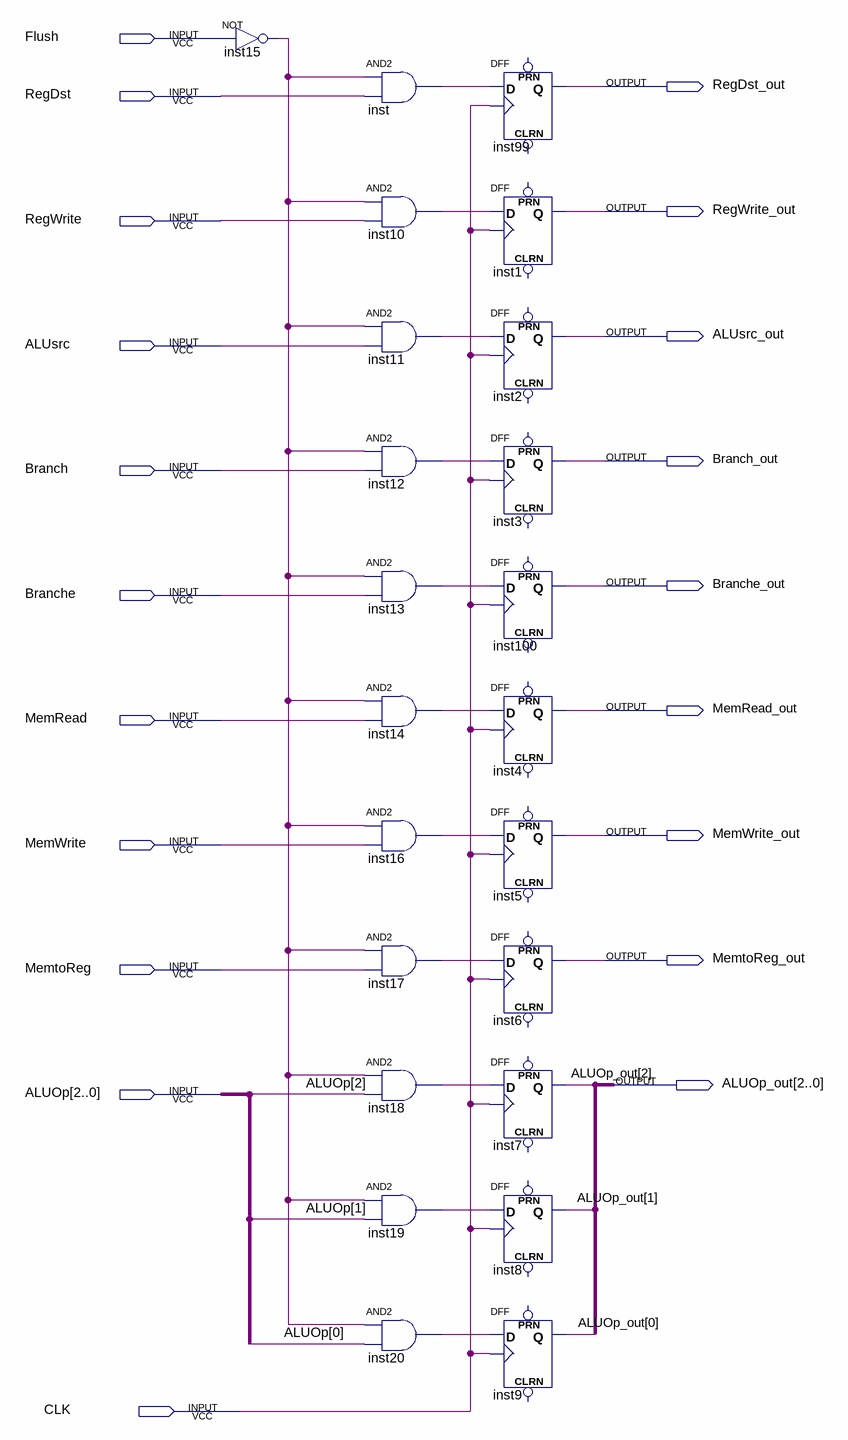
[diagram p0: schematic sheet]
// Quartus schematic ID_EX_control.bdf as structural Verilog: 23 symbols, 20 pins
module ID_EX_control (
  input  Flush,
  input  RegDst,
  input  RegWrite,
  input  ALUsrc,
  input  Branch,
  input  Branche,
  input  MemRead,
  input  MemWrite,
  input  MemtoReg,
  input  [2:0] ALUOp,
  input  CLK,
  output RegDst_out,
  output RegWrite_out,
  output ALUsrc_out,
  output Branch_out,
  output Branche_out,
  output MemRead_out,
  output MemWrite_out,
  output MemtoReg_out,
  output [2:0] ALUOp_out
);

  wire inst10_out, inst11_out, inst12_out, inst13_out, inst14_out, inst15_out, inst16_out, inst17_out,
       inst18_out, inst19_out, inst20_out, inst_out;

  not inst15 (inst15_out, Flush);
  and inst (inst_out, inst15_out, RegDst);
  and inst10 (inst10_out, inst15_out, RegWrite);
  and inst11 (inst11_out, inst15_out, ALUsrc);
  and inst12 (inst12_out, inst15_out, Branch);
  and inst13 (inst13_out, inst15_out, Branche);
  and inst14 (inst14_out, inst15_out, MemRead);
  and inst16 (inst16_out, inst15_out, MemWrite);
  and inst17 (inst17_out, inst15_out, MemtoReg);
  and inst18 (inst18_out, inst15_out, ALUOp[2]);
  and inst19 (inst19_out, inst15_out, ALUOp[1]);
  and inst20 (inst20_out, inst15_out, ALUOp[0]);
  DFF inst99 (.CLK(CLK), .D(inst_out), .Q(RegDst_out));  // open: CLRN, PRN
  DFF inst1 (.CLK(CLK), .D(inst10_out), .Q(RegWrite_out));  // open: CLRN, PRN
  DFF inst2 (.CLK(CLK), .D(inst11_out), .Q(ALUsrc_out));  // open: CLRN, PRN
  DFF inst3 (.CLK(CLK), .D(inst12_out), .Q(Branch_out));  // open: CLRN, PRN
  DFF inst100 (.CLK(CLK), .D(inst13_out), .Q(Branche_out));  // open: CLRN, PRN
  DFF inst4 (.CLK(CLK), .D(inst14_out), .Q(MemRead_out));  // open: CLRN, PRN
  DFF inst5 (.CLK(CLK), .D(inst16_out), .Q(MemWrite_out));  // open: CLRN, PRN
  DFF inst6 (.CLK(CLK), .D(inst17_out), .Q(MemtoReg_out));  // open: CLRN, PRN
  DFF inst7 (.CLK(CLK), .D(inst18_out), .Q(ALUOp_out[2]));  // open: CLRN, PRN
  DFF inst8 (.CLK(CLK), .D(inst19_out), .Q(ALUOp_out[1]));  // open: CLRN, PRN
  DFF inst9 (.CLK(CLK), .D(inst20_out), .Q(ALUOp_out[0]));  // open: CLRN, PRN
endmodule
